# EAGLE design tapclip (EAGLE 6.2)
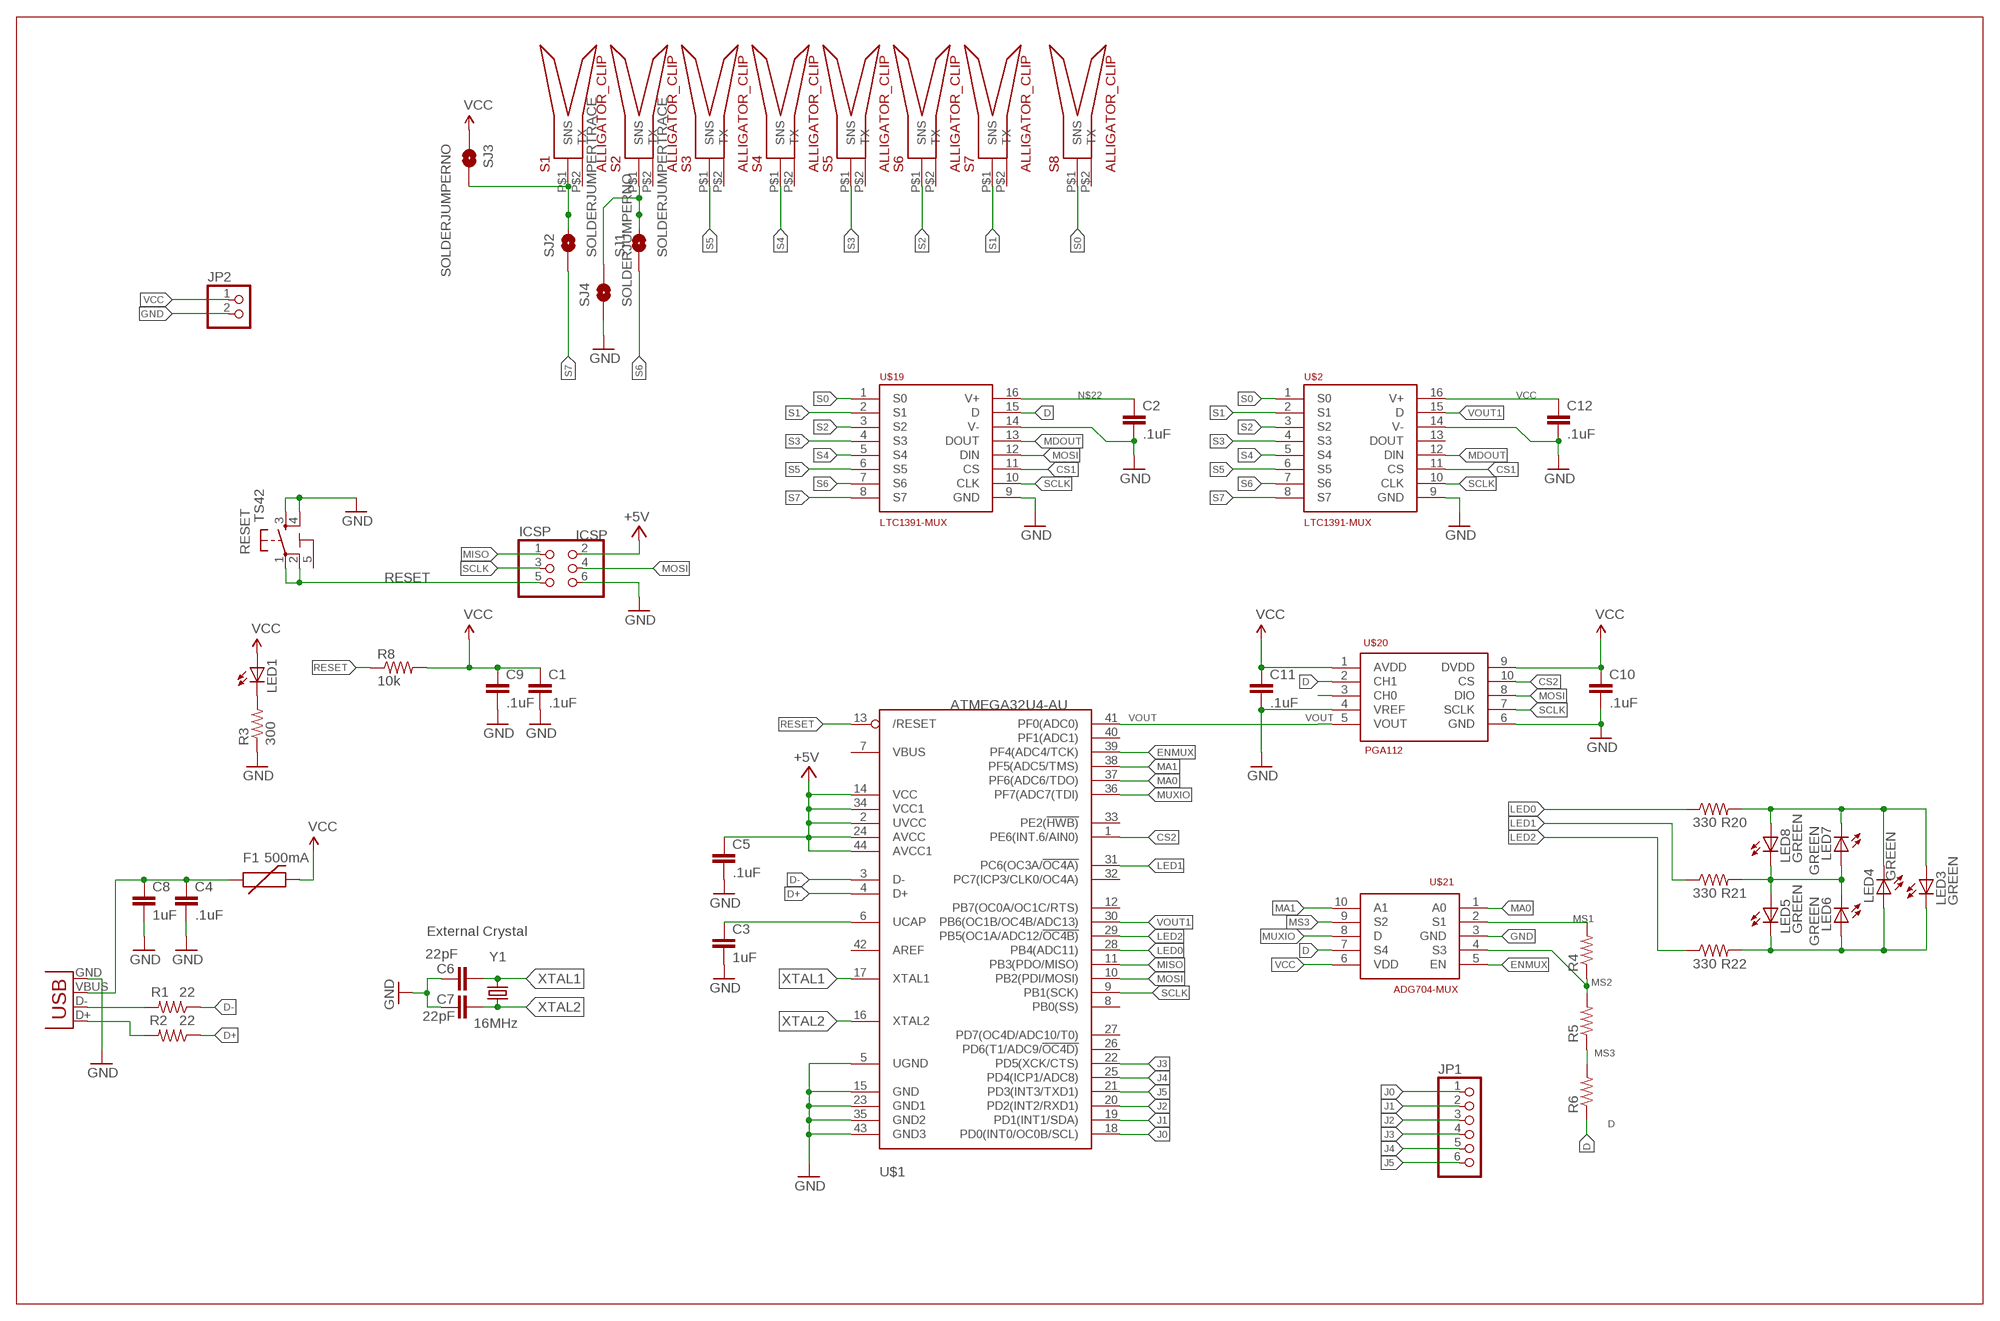
[diagram p0: schematic, sheet 1]

## Parts
C1  .1uF  CAP0603-CAP  [0603-CAP]
C2  .1uF  CAP0603-CAP  [0603-CAP]
C3  1uF  CAP0603-CAP  [0603-CAP]
C4  .1uF  CAP0603-CAP  [0603-CAP]
C5  .1uF  CAP0603-CAP  [0603-CAP]
C6  22pF  CAP0402-CAP  [0402-CAP]
C7  22pF  CAP0402-CAP  [0402-CAP]
C8  1uF  CAP0603-CAP  [0603-CAP]
C9  .1uF  CAP0603-CAP  [0603-CAP]
C10  .1uF  CAP0603-CAP  [0603-CAP]
C11  .1uF  CAP0603-CAP  [0603-CAP]
C12  .1uF  CAP0603-CAP  [0603-CAP]
F1  500mA  PTCSMD  [PTC-1206]
ICSP  ICSP  PINHD-2X3  [2X03]
JP1  PINHD-1X6CB  [1X06-CLEANBIG]
JP2  PINHD-1X2  [1X02]
LED1  LED0603  [LED-0603]
LED3  GREEN  LED0603  [LED-0603]
LED4  GREEN  LED0603  [LED-0603]
LED5  GREEN  LED0603  [LED-0603]
LED6  GREEN  LED0603  [LED-0603]
LED7  GREEN  LED0603  [LED-0603]
LED8  GREEN  LED0603  [LED-0603]
R1  22  RESISTOR0402-RES  [0402-RES]
R2  22  RESISTOR0402-RES  [0402-RES]
R3  300  RESISTOR0603-RES  [0603-RES]
R4  RESISTOR0603-RES  [0603-RES]
R5  RESISTOR0603-RES  [0603-RES]
R6  RESISTOR0603-RES  [0603-RES]
R8  10k  RESISTOR0603-RES  [0603-RES]
R20  330  RESISTOR0402-RES  [0402-RES]
R21  330  RESISTOR0402-RES  [0402-RES]
R22  330  RESISTOR0402-RES  [0402-RES]
RESET  TS42  [TS42]
S1  ALLIGATOR_CLIP  [ALLIGATOR_CLIP]
S2  ALLIGATOR_CLIP  [ALLIGATOR_CLIP]
S3  ALLIGATOR_CLIP  [ALLIGATOR_CLIP]
S4  ALLIGATOR_CLIP  [ALLIGATOR_CLIP]
S5  ALLIGATOR_CLIP  [ALLIGATOR_CLIP]
S6  ALLIGATOR_CLIP  [ALLIGATOR_CLIP]
S7  ALLIGATOR_CLIP  [ALLIGATOR_CLIP]
S8  ALLIGATOR_CLIP  [ALLIGATOR_CLIP]
SJ1  SOLDERJUMPERTRACE  [SJ_2S-TRACE]
SJ2  SOLDERJUMPERTRACE  [SJ_2S-TRACE]
SJ3  SOLDERJUMPERNO  [SJ_2S-NO]
SJ4  SOLDERJUMPERNO  [SJ_2S-NO]
U$1  ATMEGA32U4-AU  [TQFP44]
U$2  LTC1391-MUX  [SOIC16N]
U$19  LTC1391-MUX  [SOIC16N]
U$20  PGA112  [MICROSOIC10]
U$21  ADG704-MUX  [MICROSOIC10]
X1  USBSMD  [USB-MINIB]
Y1  16MHz  CRYSTAL5X3  [CRYSTAL-SMD-5X3]

## Nets
CS1: U$2.11(CS) U$19.11(CS)
CS2: U$1.1(PE6(INT.6/AIN0)) U$20.10(CS)
D: R6.1 U$19.15(D) U$20.2(CH1) U$21.7(S4)
D+: R2.1 U$1.4(D+)
D-: R1.1 U$1.3(D-)
ENMUX: U$1.39(PF4(ADC4/TCK)) U$21.5(EN)
GND [gnd]: C1.2 C2.2 C3.2 C4.2 C5.2 C6.2 C7.2 C8.2 C9.2 C10.2 C11.2 C12.2 ICSP.6 JP2.2 R3.1 RESET.3 RESET.4 SJ4.1 U$1.5(UGND) U$1.15(GND) U$1.23(GND1) U$1.35(GND2) U$1.43(GND3) U$2.9(GND) U$2.14(V-) U$19.9(GND) U$19.14(V-) U$20.4(VREF) U$20.6(GND) U$21.3(GND) X1.GND
J0: JP1.1 U$1.18(PD0(INT0/OC0B/SCL))
J1: JP1.2 U$1.19(PD1(INT1/SDA))
J2: JP1.3 U$1.20(PD2(INT2/RXD1))
J3: JP1.4 U$1.22(PD5(XCK/CTS))
J4: JP1.5 U$1.25(PD4(ICP1/ADC8))
J5: JP1.6 U$1.21(PD3(INT3/TXD1))
LED0: R20.1 U$1.28(PB4(ADC11))
LED1: R21.1 U$1.31(PC6(OC3A/!OC4A))
LED2: R22.1 U$1.29(PB5(OC1A/ADC12/!OC4B))
MA0: U$1.37(PF6(ADC6/TDO)) U$21.1(A0)
MA1: U$1.38(PF5(ADC5/TMS)) U$21.10(A1)
MDOUT: U$2.12(DIN) U$19.13(DOUT)
MISO: ICSP.1 U$1.11(PB3(PDO/MISO))
MOSI: ICSP.4 U$1.10(PB2(PDI/MOSI)) U$19.12(DIN) U$20.8(DIO)
MS1: R4.2 U$21.2(S1)
MS2: R4.1 R5.2 U$21.4(S3)
MS3: R5.1 R6.2 U$21.9(S2)
MUXIO: U$1.36(PF7(ADC7(TDI)) U$21.8(D)
N$1: C3.1 U$1.6(UCAP)
N$2: LED1.C R3.2
N$5: C4.1 C8.1 F1.1 X1.VBUS
N$6: R1.2 X1.D-
N$8: R2.2 X1.D+
N$15: S1.P$1(SNS) SJ2.2 SJ3.2
N$19: S2.P$1(SNS) SJ1.2 SJ4.2
N$22: C2.1 U$19.16(V+)
N$24: LED5.A LED6.C LED7.A LED8.C R21.2
N$25: LED3.A LED4.C LED7.C LED8.A R20.2
N$26: LED3.C LED4.A LED5.C LED6.A R22.2
N$30: U$20.3(CH0)
RESET: ICSP.5 R8.1 RESET.1 RESET.2 U$1.13(/RESET)
S0: S8.P$1(SNS) U$2.1(S0) U$19.1(S0)
S1: S7.P$1(SNS) U$2.2(S1) U$19.2(S1)
S2: S6.P$1(SNS) U$2.3(S2) U$19.3(S2)
S3: S5.P$1(SNS) U$2.4(S3) U$19.4(S3)
S4: S4.P$1(SNS) U$2.5(S4) U$19.5(S4)
S5: S3.P$1(SNS) U$2.6(S5) U$19.6(S5)
S6: SJ1.1 U$2.7(S6) U$19.7(S6)
S7: SJ2.1 U$2.8(S7) U$19.8(S7)
SCLK: ICSP.3 U$1.9(PB1(SCK)) U$2.10(CLK) U$19.10(CLK) U$20.7(SCLK)
VCC: C1.1 C5.1 C9.1 C10.1 C11.1 C12.1 F1.2 ICSP.2 JP2.1 LED1.A R8.2 SJ3.1 U$1.2(UVCC) U$1.14(VCC) U$1.24(AVCC) U$1.34(VCC1) U$1.44(AVCC1) U$2.16(V+) U$20.1(AVDD) U$20.9(DVDD) U$21.6(VDD) ; supply symbol labelled +5V
VOUT [vcc]: U$1.41(PF0(ADC0)) U$20.5(VOUT)
VOUT1: U$1.30(PB6(OC1B/OC4B/ADC13)) U$2.15(D)
XTAL1: C6.1 U$1.17(XTAL1) Y1.3
XTAL2: C7.1 U$1.16(XTAL2) Y1.1
Unconnected: S1.P$2(TX) S2.P$2(TX) S3.P$2(TX) S4.P$2(TX) S5.P$2(TX) S6.P$2(TX) S7.P$2(TX) S8.P$2(TX) U$1.7(VBUS) U$1.8(PB0(SS)) U$1.12(PB7(OC0A/OC1C/RTS)) U$1.26(PD6(T1/ADC9/!OC4D)) U$1.27(PD7(OC4D/ADC10/T0)) U$1.32(PC7(ICP3/CLK0/OC4A)) U$1.33(PE2(!HWB)) U$1.40(PF1(ADC1)) U$1.42(AREF) U$2.13(DOUT)

## Notes on the sheet
- External Crystal

## Power pins joined to a net without a drawn wire
5-GND: RESET.5(5-GND)

## Library data of the parts
C1-C12 = SparkFun:CAP: Capacitor Standard 0603 ceramic capacitor, and 0.1" leaded capacitor.
F1 = SparkFun-PowerIC:PTC: Resettable Fuse PTC Resettable Fuse. Spark Fun Electronics SKU : COM-08357
ICSP = SmartPrj:PINHD-2X3: PIN HEADER
JP1 = adafruit:PINHD-1X6: PIN HEADER
JP2 = pinhead:PINHD-1X2: PIN HEADER
LED1 LED3-LED8 = SparkFun:LED: LEDs Standard schematic elements and footprints for 5mm, 3mm, 1206, and 0603 sized LEDs. 5mm - Spark Fun Electronics SKU : COM-00529 (and others)
R1-R6 R8 = SparkFun:RESISTOR: Resistor Basic schematic elements and footprints for 0603, 1206, and PTH resistors.
R20-R22 = SparkFun-Passives:RESISTOR: Resistor Basic schematic elements and footprints for 0603, 1206, and PTH resistors.
RESET = SmartPrj:TS42: TS42 Dongnan Electronics Tact switch VDC 12V - 50mA
S1-S8 = sdgj:ALLIGATOR_CLIP
SJ1-SJ4 = SparkFun:SOLDERJUMPER: Solder Jumper Standard SMD solder jumper. Used to automate production. Two varients : Normally Open and Normally Closed are the same, but have different paste layers. NC will have a large amount of paste and should jumper during reflow.
U$1 = adafruit:ATMEGA32U4: http://www.ladyada.net/library/eagle
U$2 U$19 = sdgj:LTC1391-MUX
U$20 = sdgj:PGA112
U$21 = sdgj:ADG704-MUX
X1 = SparkFun:USB: USB Connectors USB-B-PTH is fully proven SKU : PRT-00139 USB-miniB is fully proven SKU : PRT-00587 USB-A-PCB is untested. USB-A-H is throughly reviewed, but untested. Spark Fun Electronics SKU : PRT-00437 USB-B-SMT is throughly reviewed, but untested. Needs silkscreen touching up. USB-A-S has not been used/tested USB-MB-H has not been used/tested
Y1 = SparkFun:CRYSTAL: Crystals Various standard crystals. Proven footprints. Spark Fun Electronics SKU : COM-00534

## Net classes
0 default: width 0.203 mm
2 gnd: width 0.254 mm, drill 0.61 mm, clearance 0.254 mm
3 usbvcc: width 0.254 mm, drill 0.61 mm, clearance 0.254 mm

## Board
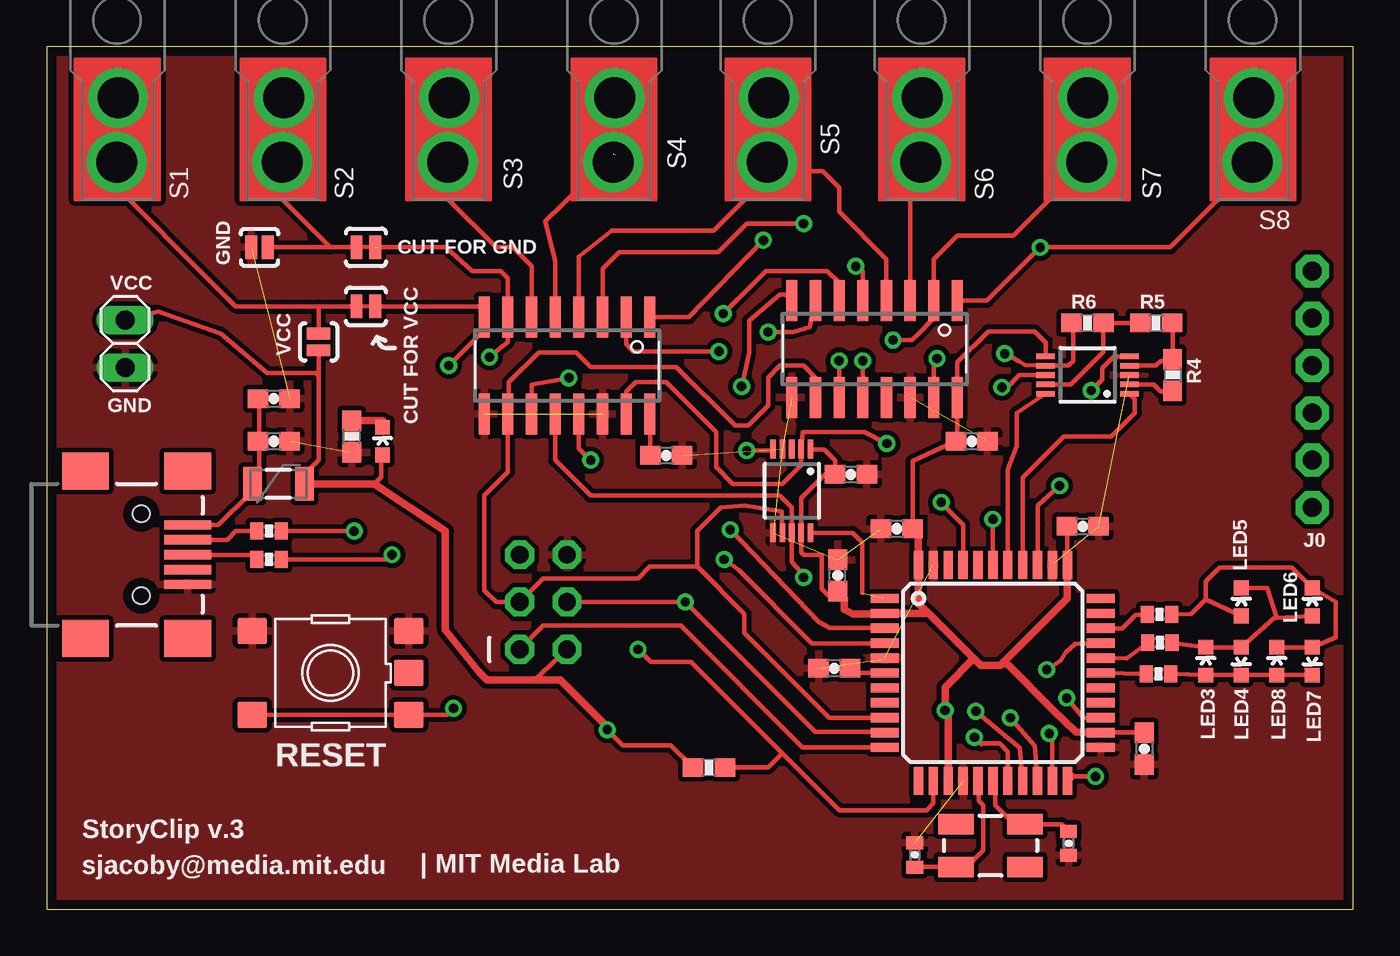
[diagram p1: board, top side]
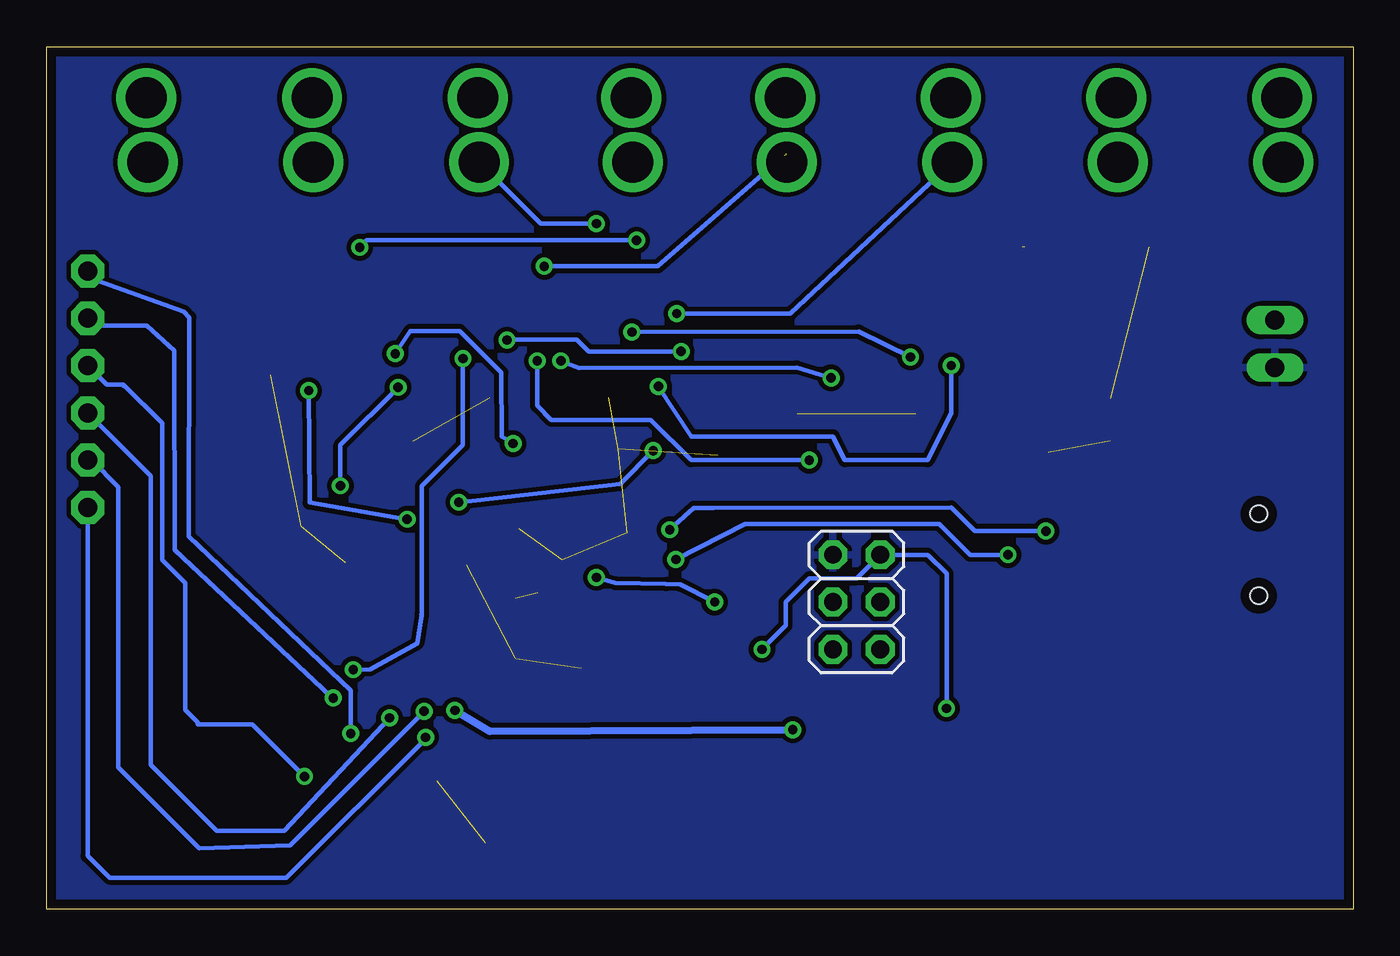
[diagram p2: board, bottom side, seen from below]

Size 70.16 x 46.34 mm. Coordinates in mm from the lower left corner, seen from the top.
Outline: 0,0 70.16,0 70.16,46.34 0,46.34 0,0
Copper layers (1*16): Top 0.035mm / dielectric 1.5mm / Bottom 0.035mm
Design rules: minimum track width 10mil, minimum drill 24mil, track to track 8mil, track to pad 6mil, pad to pad 6mil, via to via 8mil, smd to smd 6mil, copper to edge 20mil, drill to drill 8mil, minimum pad ring 10mil, minimum via ring 8mil, stop-mask expansion 4mil, vias tented up to drill 0mil, thermal gap 10mil

### Footprints (pad centres in the part's own frame; a part is rotated, then mirrored left to right if it is on the bottom)
0603-CAP = smd 1.1 x 1: 1 -0.85,0; 2 0.85,0
0402-CAP = smd 0.7 x 0.9: 1 -0.65,0; 2 0.65,0
PTC-1206 = smd 1 x 1.8: 1 -1.4,0; 2 1.4,0
2X03 = drill 0.95 pad 1.55 octagon: 1 -2.54,-1.27; 2 -2.54,1.27; 3 0,-1.27; 4 0,1.27; 5 2.54,-1.27; 6 2.54,1.27
1X06-CLEANBIG = drill 1.016 pad 1.778 octagon: 1 -6.35,0; 2 -3.81,0; 3 -1.27,0; 4 1.27,0; 5 3.81,0; 6 6.35,0
1X02 = drill 1.016 long: 1 -1.27,0; 2 1.27,0
LED-0603 = smd 0.8 x 0.8: A 0,-0.75; C 0,0.75
0402-RES = smd 0.7 x 0.9: 1 -0.65,0; 2 0.65,0
0603-RES = smd 1.1 x 1: 1 -0.85,0; 2 0.85,0
TS42 = smd 1.6 x 1.4: 1 -4.2,2.25; 2 4.2,2.25; 3 -4.2,-2.25; 4 4.2,-2.25; 5 -4.2,0
ALLIGATOR_CLIP = drill 2.2 pad 2.54: P$1 -1.778,0.051; P$2 1.676,-0.025
SJ_2S-TRACE = smd 0.635 x 1.27: 1 -0.508,0; 2 0.508,0
SJ_2S-NO = smd 0.635 x 1.27: 1 -0.45,0; 2 0.45,0
TQFP44 = smd 1.5 x 0.5: 1 -5.8,4; 2 -5.8,3.2; 3 -5.8,2.4; 4 -5.8,1.6; 5 -5.8,0.8; 6 -5.8,0; 7 -5.8,-0.8; 8 -5.8,-1.6; 9 -5.8,-2.4; 10 -5.8,-3.2; 11 -5.8,-4; 23 5.8,-4; 24 5.8,-3.2; 25 5.8,-2.4; 26 5.8,-1.6; 27 5.8,-0.8; 28 5.8,0; 29 5.8,0.8; 30 5.8,1.6; 31 5.8,2.4; 32 5.8,3.2; 33 5.8,4 | smd 0.5 x 1.5: 12 -4,-5.8; 13 -3.2,-5.8; 14 -2.4,-5.8; 15 -1.6,-5.8; 16 -0.8,-5.8; 17 0,-5.8; 18 0.8,-5.8; 19 1.6,-5.8; 20 2.4,-5.8; 21 3.2,-5.8; 22 4,-5.8; 34 4,5.8; 35 3.2,5.8; 36 2.4,5.8; 37 1.6,5.8; 38 0.8,5.8; 39 0,5.8; 40 -0.8,5.8; 41 -1.6,5.8; 42 -2.4,5.8; 43 -3.2,5.8; 44 -4,5.8
SOIC16N = smd 0.6 x 2.2: 1 -4.445,-2.6; 2 -3.175,-2.6; 3 -1.905,-2.6; 4 -0.635,-2.6; 5 0.635,-2.6; 6 1.905,-2.6; 7 3.175,-2.6; 8 4.445,-2.6; 9 4.445,2.6; 10 3.175,2.6; 11 1.905,2.6; 12 0.635,2.6; 13 -0.635,2.6; 14 -1.905,2.6; 15 -3.175,2.6; 16 -4.445,2.6
MICROSOIC10 = smd 0.3 x 1: 1 -1,-2.25; 2 -0.5,-2.25; 3 0,-2.25; 4 0.5,-2.25; 5 1,-2.25; 6 1,2.25; 7 0.5,2.25; 8 0,2.25; 9 -0.5,2.25; 10 -1,2.25
USB-MINIB = smd 2.5 x 0.5: D+ 2.5,0; D- 2.5,0.8; GND 2.5,-1.6; ID 2.5,-0.8; VBUS 2.5,1.6 | smd 2.5 x 2: MTN1 -3,4.5; MTN2 2.5,4.5; MTN3 -3,-4.5; MTN4 2.5,-4.5 | hole 0.9: 0,2.2; 0,-2.2
CRYSTAL-SMD-5X3 = smd 1.9 x 1.1: 1 -1.85,-1.15; 2 1.85,-1.15; 3 1.85,1.15; 4 -1.85,1.15

### Placement (x,y rotation side)
C1  55.63,20.57 0 top
C2  33.27,24.38 0 top
C3  42.29,12.95 180 top
C4  12.19,27.43 0 top
C5  58.93,8.64 270 top
C6  54.86,3.56 270 top
C7  46.61,2.92 90 top
C8  12.19,25.15 0 top
C9  45.64,20.45 180 top
C10  43.18,23.37 0 top
C11  42.47,17.93 90 top
C12  49.66,25.15 0 top
F1  12.45,22.86 0 top
ICSP  26.67,16.51 90 bottom
JP1  67.94,27.94 90 top
JP2  4.22,30.38 270 top
LED1  18.03,25.15 0 top
LED3  62.23,13.34 0 top
LED4  64.14,13.34 180 top
LED5  64.14,16.51 0 top
LED6  67.94,16.51 0 top
LED7  67.94,13.34 180 top
LED8  66.04,13.34 0 top
R1  11.94,20.32 180 top
R2  11.94,18.8 180 top
R3  16.38,25.4 90 top
R4  60.45,28.7 270 top
R5  59.56,31.5 0 top
R6  55.88,31.5 0 top
R8  35.56,7.62 180 top
R20  59.69,12.65 0 top
R21  59.74,15.85 0 top
R22  59.77,14.33 0 top
RESET  15.24,12.7 180 top
S1  3.81,41.91 90 top
S2  12.7,41.91 90 top
S3  21.59,41.91 90 top
S4  30.48,41.91 90 top
S5  38.73,41.91 90 top
S6  46.99,41.91 90 top
S7  55.88,41.91 90 top
S8  64.77,41.91 90 top
SJ1  17.14,35.56 180 top
SJ2  17.14,32.38 180 top
SJ3  14.61,30.48 90 top
SJ4  11.43,35.56 0 top
U$1  50.8,12.7 0 top
U$2  44.45,30.1 180 top
U$19  27.94,29.21 180 top
U$20  40.01,22.48 180 top
U$21  55.88,28.7 90 top
X1  5.08,19.05 0 top
Y1  50.67,3.43 0 top

### Tracks (layer width: path | path; a pad name or v marks a point on that pad's centre or on a via)
CS1  (via drill 0.5, 0.5 pad 0.51)
  Top 0.254: U$19.11 26.04,28.19 v28.04,28.55 | v42.55,29.46 U$2.11
  Bottom 0.254: v28.04,28.55 29.9,29.11 41.55,29.08 v42.55,29.46
CS2  (1 unrouted)
  Top 0.254: U$20.10 43.27,20.23 43.79,19.71 43.79,16.99
D  (via drill 0.5)
  Top 0.254: U$20.2 | U$19.15 31.11,27.81 31.62,28.32 33.27,28.32 35.94,25.65 35.94,23.75 36.83,22.86 39.5,22.86 40.51,23.88 U$20.2 | R6.1 55.12,31.41 55.12,29.46 54.86,29.2 U$21.7 52.53,29.23 52.2,29.46 v51.44,29.84 | U$20.2 40.61,25.65 41.3,25.65 43.89,25.65 v45.11,25.02
  Bottom 0.254: v45.11,25.02 45.72,25.4 45.74,28.83 47.98,31.06 50.62,31.06 v51.44,29.84
D+  (via drill 0.5)
  Top 0.254: R2.1 18.29,18.8 v18.54,19.05 | v36.37,18.8 37.13,18.26 41.02,14.35 41.07,14.3 U$1.4
  Bottom 0.254: v18.54,19.05 20.57,19.05 22.23,20.7 32.64,20.7 v36.37,18.8
D-  (via drill 0.5)
  Top 0.254: R1.1 v16.51,20.32 | v36.7,20.4 41.45,15.44 42.04,15.11 44.99,15.11 U$1.3
  Bottom 0.254: v16.51,20.32 20.32,20.32 21.59,21.59 34.34,21.57 35.41,21.57 v36.7,20.4
ENMUX  (via drill 0.5)
  Top 0.254: U$21.5 57.29,29.7 56.67,29.08 56.67,28.45 v56.08,27.86 | v50.8,20.95 U$1.39
  Bottom 0.254: v56.08,27.86 56.03,21.84 v50.8,20.95
GND  (14 unrouted)
  Top 0.254: 54.1,18.6 U$1.35 | 44.96,13.46 U$1.5
  pour Top (isolate 0.254): 0,0 70.13,0 70.13,46.28 -0.03,46.28 -0.03,0
  pour Bottom (isolate 0.254): -0.05,0 70.1,0 70.1,46.28 -0.05,46.28
J0  (via drill 0.5)
  Top 0.254: U$1.18 51.6,8.47 51.16,8.91 50.22,8.91 50.16,8.87 50.16,8.89 v49.81,9.25
  Bottom 0.254: v49.81,9.25 49.81,9.17 57.28,1.7 66.78,1.7 67.94,2.87 JP1.1
J1  (via drill 0.5)
  Top 0.254: U$1.19 52.25,8.69 v49.89,10.64
  Bottom 0.254: v49.89,10.64 57.07,3.45 61.95,3.28 66.29,7.62 66.29,22.68 67.74,24.13 JP1.2
J2  (via drill 0.5)
  Top 0.254: U$1.20 53.05,8.78 v51.74,10.29
  Bottom 0.254: v51.74,10.29 57.4,4.22 61.01,4.22 64.57,7.77 64.57,23.29 JP1.3
J3  (via drill 0.5)
  Top 0.254: 55.04,7.14 v56.31,7.14
  Top 0.406: U$1.22 55.04,7.14
  Bottom 0.254: v56.31,7.14 59.11,9.93 62.03,9.93 62.03,10.03 62.71,10.72 62.71,17.53 63.96,18.77 63.96,26.11 66.04,28.19 | 66.04,28.19 66.04,28.14 66.02,28.12 | 66.04,28.19 66.93,28.19 JP1.4
J4  (via drill 0.5)
  Top 0.254: U$1.25 55.64,10.3 v54.76,11.35
  Bottom 0.254: v54.76,11.35 54.89,11.43 63.27,19.3 63.3,30.02 64.77,31.37 67.56,31.37 JP1.5
J5  (via drill 0.5)
  Top 0.254: U$1.21 54,9.27 v53.82,9.45
  Bottom 0.254: v53.82,9.45 53.82,11.76 62.51,20.04 62.48,31.8 62.79,32.11 67.44,33.78 JP1.6
LED0
  Top 0.254: U$1.28 R20.1
LED1
  Top 0.254: U$1.31 57.75,15.1 58.47,15.82 59.06,15.82 R21.1
LED2
  Top 0.254: U$1.29 57.99,13.49 R22.1
MA0
  Top 0.254: U$1.37 52.4,23.19 54.61,25.4 57.15,25.4 58.42,26.67 58.42,27.41 U$21.1 58.11,27.69
MA1
  Top 0.254: U$1.38 51.6,23.64 52.07,24.89 52.07,26.67 52.58,27.02 U$21.10
MDOUT  (via drill 0.5)
  Top 0.254: U$19.13 28.57,24.77 v29.21,24.13 | v43.81,29.46 43.81,29.08 U$2.12
  Bottom 0.254: v29.21,24.13 35.56,24.13 37.72,26.29 43.05,26.29 43.81,27.05 v43.81,29.46
MISO
  Top 0.254: U$1.11 40.58,8.7 34.04,15.24 26.67,15.24 ICSP.1
MOSI  (via drill 0.5)
  Top 0.254: ICSP.4 v34.29,16.51 41.27,9.53 44.98,9.53 U$1.10 | v40.64,17.83 40.74,17.83 40.01,18.67 U$20.8 40.01,21.59 39.37,22.23 29.21,22.23 27.3,24.13 U$19.12
  Bottom 0.254: v34.29,16.51 36.14,17.45 36.91,17.48 39.62,17.53 v40.64,17.83
MS1
  Top 0.254: U$21.2 59.43,28.2 59.82,27.81 60.41,27.81 R4.2
MS2
  Top 0.254: U$21.4 59.55,29.2 59.82,29.46 60.36,29.46 R4.1 60.45,31.46 R5.2
MS3
  Top 0.254: R5.1 R6.2 56.73,29.93 54.99,28.19 U$21.9
MUXIO  (via drill 0.5)
  Top 0.254: U$1.36 53.2,20.64 53.21,20.65 53.21,21.69 v54.38,22.76 | v51.28,28.04 51.56,28.04 52.22,28.7 U$21.8
  Bottom 0.254: v54.38,22.76 54.38,24.94 v51.28,28.04
N$1
  Top 0.254: U$1.6 43.4,12.7 C3.1
N$2
  Top 0.406: R3.2 18.03,26.25 LED1.C
N$5
  Top 0.254: X1.VBUS 9.22,20.65 10.92,22.35 10.92,22.74 F1.1 11.43,23.24 11.43,25.4 | C8.1 11.34,25.31 11.43,25.4 | 11.43,25.4 11.43,27.6 C4.1
N$6
  Top 0.254: X1.D- 9.69,19.85 10.16,20.32 R1.2
N$8
  Top 0.254: X1.D+ 11.03,19.05 R2.2
N$15
  Top 0.254: S1.P$1 2.41,40.13 10.16,32.38 14.61,32.38 | 14.61,32.38 SJ2.2 | SJ3.2 14.61,32.38
N$19
  Top 0.254: SJ1.2 15.24,35.56 | 15.24,35.56 12.7,38.1 12.7,40.08 S2.P$1 | SJ4.2 15.24,35.56
N$22
  Top 0.254: C2.1 32.38,25.82 | 32.38,25.78 U$19.16
  Top 0.406: 32.38,25.82 32.38,25.78
N$24
  Top 0.254: LED8.C LED7.A 69.22,14.61 69.22,16.51 LED6.C 66.84,18.36 62.97,18.36 62.23,17.63 62.23,16.66 | LED5.A 62.23,16.66 | R21.2 61.44,15.88 62.23,16.66
N$25
  Top 0.254: R20.2 LED3.A LED4.C LED8.A LED7.C
N$26
  Top 0.254: R22.2 LED3.C LED4.A 65.91,15.65 66.05,15.65 | 66.05,15.65 LED6.A | LED5.C 65.53,17.27 66.05,15.65
RESET  (via drill 0.5)
  Top 0.254: v31.75,13.97 32.42,13.29 34.58,13.29 39.5,8.38 | RESET.2 RESET.1 21.5,10.45 v21.84,10.79 | R8.1 38.73,7.62 39.5,8.38 | 39.5,8.38 42.55,5.33 47.24,5.33 47.6,5.69 U$1.13 | U$1.13
  Bottom 0.254: v31.75,13.97 30.48,15.24 30.48,16.51 29.21,17.78 26.67,17.78 ICSP.5 22.86,19.05 21.84,18.03 v21.84,10.79
S0  (via drill 0.5)
  Top 0.254: U$19.1 34.48,31.81 v38.48,35.94 | S8.P$1 65.28,41.4 65.28,40.51 60.33,35.56 v53.34,35.56 50.48,32.7 U$2.1
  Bottom 0.254: v38.48,35.94 52.96,35.94 v53.34,35.56
S1  (via drill 0.5)
  Top 0.254: U$19.2 31.11,30.35 31.5,29.97 v36.09,29.97 | 55.88,39.37 S7.P$1 51.89,36.2 48.9,36.2 47.62,34.92 U$2.2 47.62,31.75 46.74,30.86 46.46,30.58 v45.44,30.58
  Bottom 0.254: v36.09,29.97 41.05,29.97 41.68,30.61 45.41,30.61 v45.44,30.58
S2  (via drill 0.5)
  Top 0.254: U$19.3 29.84,34.42 30.73,35.31 34.16,35.31 36.07,35.31 37.59,36.83 v40.64,36.83 | U$2.3 46.35,39.55 S6.P$1
  Bottom 0.254: v40.64,36.83 43.64,36.83 S6.P$1
S3
  Top 0.254: U$19.4 28.57,35.05 30.35,36.45 35.81,36.45 36.2,36.83 37.47,38.1 37.47,38.28 S5.P$1 39.8,39.65 41.66,39.65 42.55,38.76 42.55,37.47 45.09,34.92 U$2.4
S4  (via drill 0.5)  (2 unrouted)
  Top 0.254: U$19.5 27.3,34.8 26.77,36.96 30.45,40.54 | 30.48,43.18 S4.P$1 | U$2.5 43.81,34.29 43.56,34.54 v43.43,34.54
  Top 0.406: S4.P$1 30.43,40.38 30.55,40.5
  Bottom 0.254: v43.43,34.54 37.34,34.54 30.45,40.59
S5  (via drill 0.5)
  Top 0.254: S3.P$1 21.59,38.1 24.13,35.56 25.02,35.56 26.04,34.54 U$19.6 | U$2.6 42.55,33.66 41.91,34.29 38.61,34.29 37.34,33.02 v36.32,32
  Bottom 0.254: v36.32,32 30.23,32 S3.P$1
S6  (via drill 0.5, 0.5 pad 0.51)  (1 unrouted)
  Top 0.254: 17.78,35.56 21.44,35.56 22.86,34.29 24.38,34.29 24.77,33.91 U$19.7 24.77,30.48 v23.77,29.67 | U$2.7 40.97,31.27 40.08,31.01 v38.73,31.01
  Bottom 0.254: v38.73,31.01 26.57,31.04 v23.77,29.67
S7  (via drill 0.5, 0.5 pad 0.51)
  Top 0.254: v21.59,29.21 23.5,31.11 U$19.8 23.5,32.38 SJ2.1 | v37.31,28.09 37.72,29.9 37.72,31.62 39.37,33.02 39.68,33.02 U$2.8
  Bottom 0.254: v21.59,29.21 21.59,26.67 22.86,24.13 27.3,24.13 27.94,25.4 35.56,25.4 v37.31,28.09
SCLK
  Top 0.254: U$1.9 42.02,10.3 37.47,14.86 37.47,15.88 34.92,18.41 | U$20.7 39.45,21.38 37.44,21.69 36.2,21.59 34.92,20.32 34.92,18.41 | U$2.10 41.27,28.57 40.64,29.21 39.37,29.21 38.73,28.57 38.73,27.05 37.67,25.98 36.96,25.98 33.81,29.13 29.21,29.13 28.42,29.92 26.42,29.92 24.82,28.32 24.82,26.66 U$19.10 24.77,23.5 23.5,22.23 23.5,17.14 24.13,16.51 ICSP.3 26.67,17.78 31.75,17.78 32.38,18.41 34.92,18.41
VCC  (via drill 0.5)
  Top 0.254: U$1.24 58.91,9.5 C5.1 | U$1.34 54.8,20.32 | 54.8,20.32 54.8,20.6 | U$1.2 45.72,15.9 45.7,15.88 | 26.21,12.32 ICSP.2 | 30.1,9.8 v30.1,9.65 30.93,8.82 33.51,8.82 R8.2 | U$20.1 41.01,24.69 41.75,24.69 42.34,24.11 C10.1 41.78,23.37 40.51,22.1 U$20.9 40.51,19.18 40.64,19.05 41.62,19.05 41.62,17.21 41.96,16.87 42.25,16.87 | C1.1 54.78,20.34 54.8,20.32 | F1.2 13.85,23.37 14.61,24.13 14.61,28.65 | 14.61,28.65 SJ3.1 | 17.6,22.86 17.96,23.22 17.96,24.32 | JP2.1 4.27,31.65 5.99,32.11 9.35,30.94 11.84,28.8 14.45,28.8 14.61,28.65 | 46.8,20.14 C9.1 46.49,24.08 C12.1 48.9,25.23 U$2.16 48.9,29.39 50.55,31.04 53.03,31.04 53.63,30.44 U$21.6 | 42.81,16.74 C11.1 | 51.21,13.11 51.64,13.11
  Top 0.305: 47.62,15.62 47.35,15.9
  Top 0.406: U$1.24 55.24,9.53 54,10.74 51.64,13.11 | 49.77,13.47 50.14,13.11 51.21,13.11 54.8,16.7 U$1.34 | 49.77,13.47 47.62,15.62 46.8,16.45 U$1.44 46.8,20.14 | 45.72,15.9 47.35,15.9 | 30.1,9.8 27.58,12.32 26.21,12.32 23.62,12.32 23.22,12.72 21.41,15.01 21.41,20.32 17.6,22.86 F1.2 | 45.7,15.88 43.28,15.88 42.81,16.11 42.81,16.74 | 17.96,24.32 LED1.A | 42.25,16.87 C11.1 | 49.77,13.47 48.23,11.94 v48.23,10.69 48.4,10.53 U$1.14
  Bottom 0.406: v30.1,9.65 46.35,9.58 v48.23,10.69
VOUT  (via drill 0.5)
  Top 0.254: 49.15,18.45 U$1.41 49.2,20.65 48.26,21.59 v48.03,21.87 | v37.59,24.64 38.91,24.64 U$20.5
  Bottom 0.254: v48.03,21.87 39.37,22.86 v37.59,24.64
VOUT1  (via drill 0.5)
  Top 0.254: U$2.15 47.62,29.31 47.65,29.34 47.65,29.44 v47.8,29.59 | v53.7,12.88 54.43,13.39 54.71,13.79 55.22,14.25 U$1.30 | U$1.30
  Bottom 0.254: v47.8,29.59 47.8,24.94 50.01,22.73 50.01,15.88 50.04,15.85 50.01,15.82 50.27,14.3 52.78,12.9 v53.7,12.88
XTAL1
  Top 0.254: C6.1 54.49,4.58 Y1.3 51.94,4.58 50.93,5.59 50.93,6.77 U$1.17
XTAL2
  Top 0.254: C7.1 Y1.1 49.4,2.28 50.29,3.17 50.29,5.59 50.04,5.84 50.04,6.86 U$1.16

### Text on the board
tNames: GND | CUT FOR GND | VCC | VCC | GND | CUT FOR VCC | J0 | StoryClip v.3 | sjacoby@media.mit.edu | | MIT Media Lab